# Altium project AIO_3399J_Schematic.PrjPcb (part 5 of 5)

## Sheet FAN.SchDoc
size B
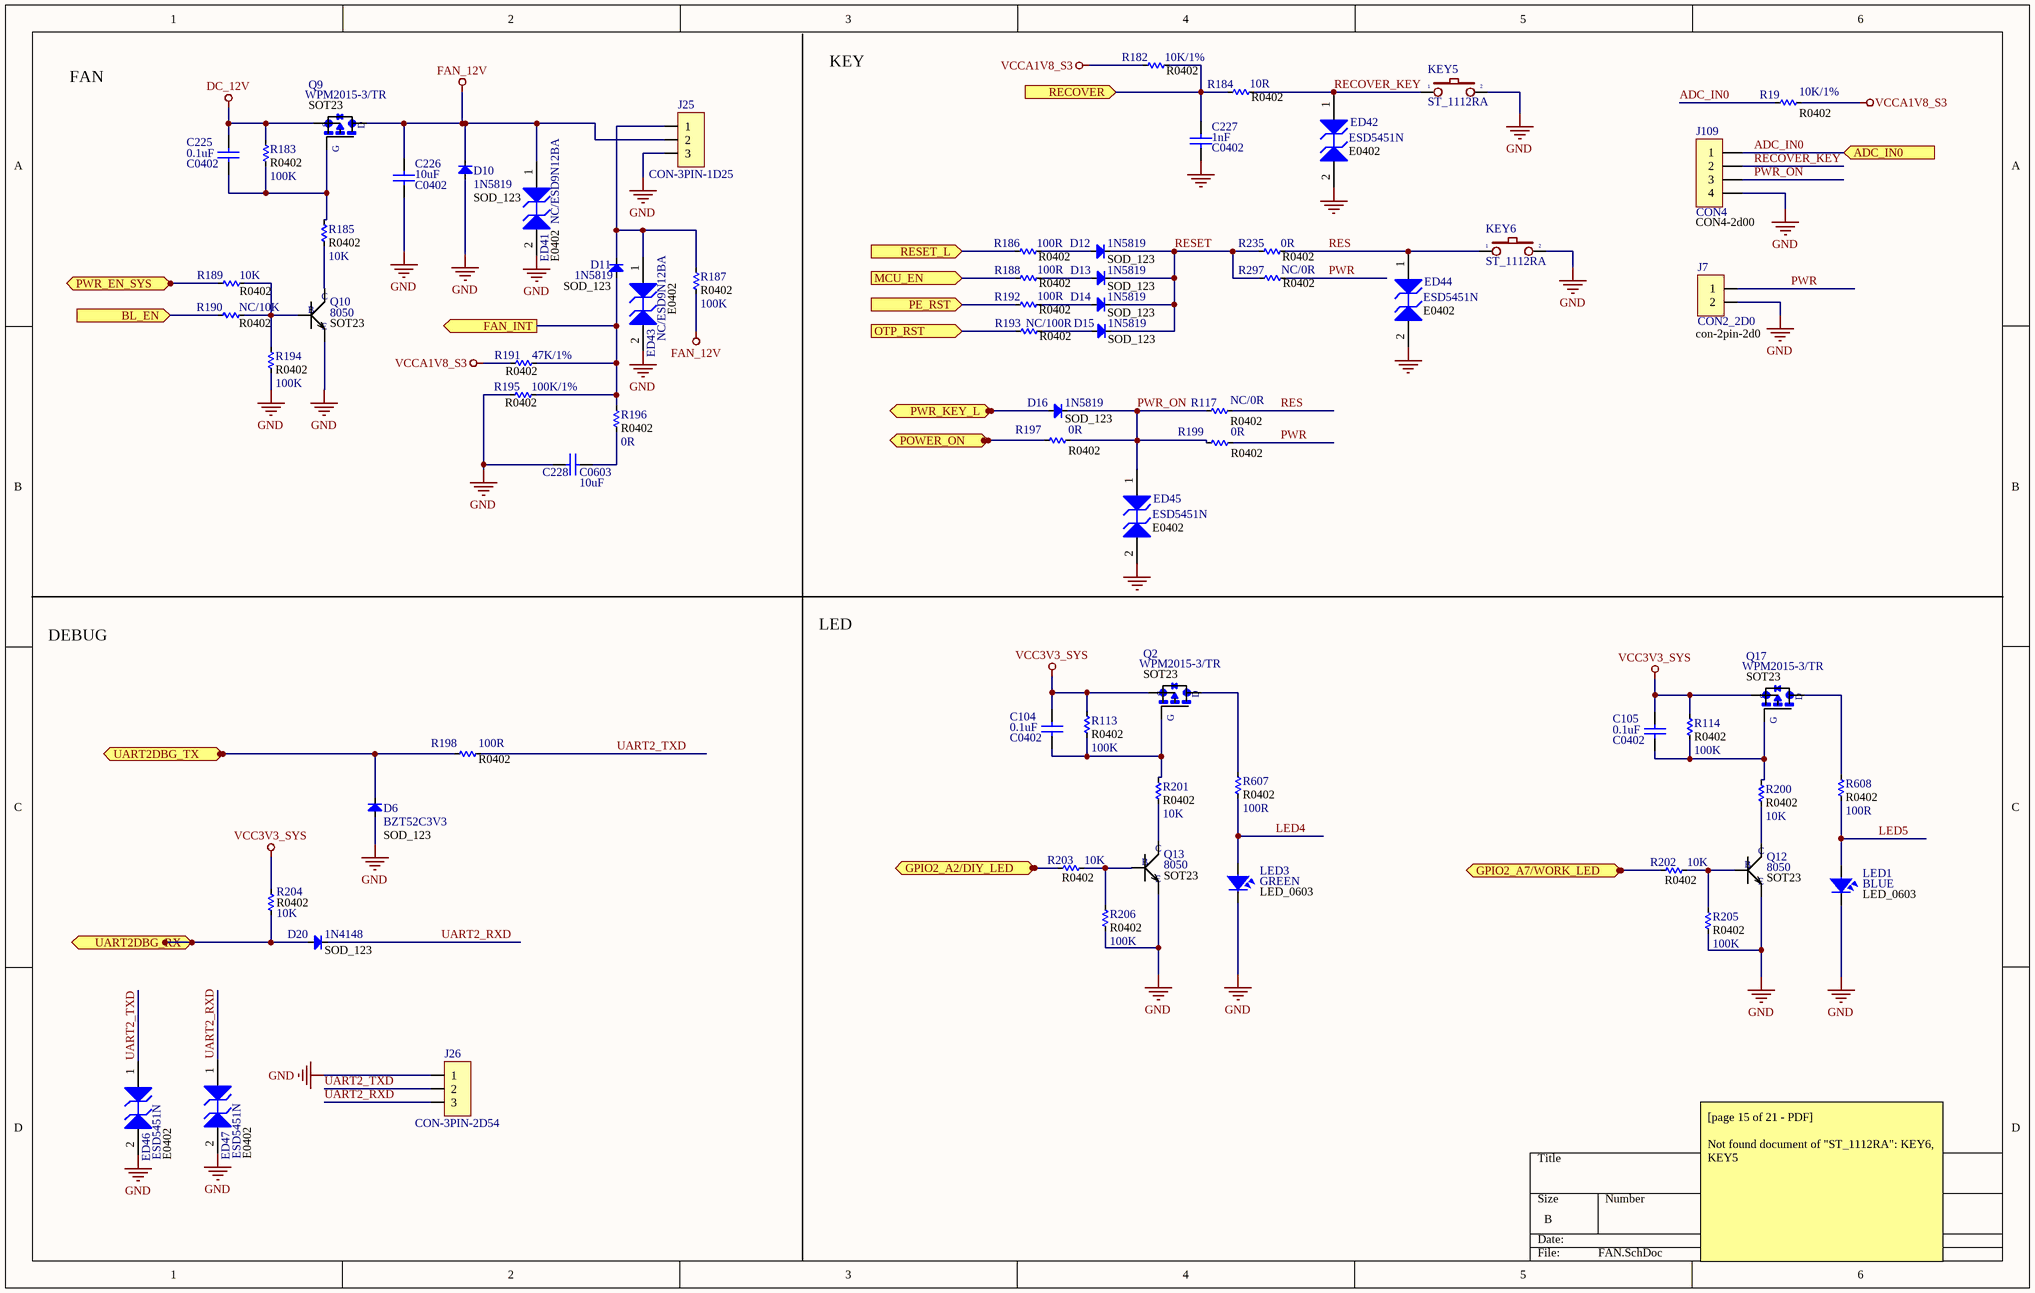
[diagram p20: FAN.SchDoc]

### Parts
C104  C0402  value 0.1uF  [C 0402]
C105  C0402  value 0.1uF  [C 0402]
C225  C0402  value 0.1uF  [C 0402]
C226  C0402  value 10uF  [C 0402]
C227  C0402  value 1nF  [C 0402]
C228  C0603  value 10uF  [C 0603]
D6  BZT52C3V3  typr: SOD_123  [DIO-SMD-123]
D10  value 1N5819  typr: SOD_123  [DIO-SMD-123]  (hidden comment: Diode SMD)
D11  value 1N5819  typr: SOD_123  [DIO-SMD-123]  (hidden comment: Diode SMD)
D12  value 1N5819  typr: SOD_123  [DIO-SMD-123]  (hidden comment: Diode SMD)
D13  value 1N5819  typr: SOD_123  [DIO-SMD-123]  (hidden comment: Diode SMD)
D14  value 1N5819  typr: SOD_123  [DIO-SMD-123]  (hidden comment: Diode SMD)
D15  value 1N5819  typr: SOD_123  [DIO-SMD-123]  (hidden comment: Diode SMD)
D16  value 1N5819  typr: SOD_123  [DIO-SMD-123]  (hidden comment: Diode SMD)
D20  value 1N4148  typr: SOD_123  [DIO-SMD-123]  (hidden comment: Diode SMD)
ED41  NC/ESD9N12BA  [DFN1006-2L]
ED42  ESD5451N  [DFN1006-2L]
ED43  NC/ESD9N12BA  [DFN1006-2L]
ED44  ESD5451N  [DFN1006-2L]
ED45  ESD5451N  [DFN1006-2L]
ED46  ESD5451N  [DFN1006-2L]
ED47  ESD5451N  [DFN1006-2L]
J7  CON2_2D0  [CON2]
J25  CON-3PIN-1D25  [CON3]
J26  CON-3PIN-2D54  [CON3]
J109  CON4  [CON4]
KEY5  ST_1112RA  [SW1-SMD]
KEY6  ST_1112RA  [SW1-SMD]
LED1  Package: LED_0603  Color: BLUE  [SM-LED-0805-Blue]  (hidden comment: LED SMD)
LED3  Package: LED_0603  Color: GREEN  [SM-LED-0805-Green]  (hidden comment: LED SMD)
Q2  WPM2015-3/TR  [*SSOT-3]
Q9  WPM2015-3/TR  [*SSOT-3]
Q10  8050  [*SOT-23]
Q12  8050  [*SOT-23]
Q13  8050  [*SOT-23]
Q17  WPM2015-3/TR  [*SSOT-3]
R19  R0402  value 10K/1%  [R 0402]
R113  R0402  value 100K  [R 0402]
R114  R0402  value 100K  [R 0402]
R117  R0402  value NC/0R  [R 0402]
R182  R0402  value 10K/1%  [R 0402]
R183  R0402  value 100K  [R 0402]
R184  R0402  value 10R  [R 0402]
R185  R0402  value 10K  [R 0402]
R186  R0402  value 100R  [R 0402]
R187  R0402  value 100K  [R 0402]
R188  R0402  value 100R  [R 0402]
R189  R0402  value 10K  [R 0402]
R190  R0402  value NC/10K  [R 0402]
R191  R0402  value 47K/1%  [R 0402]
R192  R0402  value 100R  [R 0402]
R193  R0402  value NC/100R  [R 0402]
R194  R0402  value 100K  [R 0402]
R195  R0402  value 100K/1%  [R 0402]
R196  R0402  value 0R  [R 0402]
R197  R0402  value 0R  [R 0402]
R198  R0402  value 100R  [R 0402]
R199  R0402  value 0R  [R 0402]
R200  R0402  value 10K  [R 0402]
R201  R0402  value 10K  [R 0402]
R202  R0402  value 10K  [R 0402]
R203  R0402  value 10K  [R 0402]
R204  R0402  value 10K  [R 0402]
R205  R0402  value 100K  [R 0402]
R206  R0402  value 100K  [R 0402]
R235  R0402  value 0R  [R 0402]
R297  R0402  value NC/0R  [R 0402]
R607  R0402  value 100R  [R 0402]
R608  R0402  value 100R  [R 0402]

### Ports
ADC_IN0 (in), BL_EN (in), FAN_INT (out), GPIO2_A2/DIY_LED (in), GPIO2_A7/WORK_LED (in), MCU_EN (in), OTP_RST (in), PE_RST (in), POWER_ON (in), PWR_EN_SYS (in), PWR_KEY_L (in), RECOVER (in), RESET_L (in), UART2DBG_RX (out), UART2DBG_TX (in)

### Nets
DC_12V: C225.1 Q9.2(S) R183.2
FAN_12V: C226.1 D10.2(K) ED41.1(A1) J25.2 Q9.3(D) R187.1
GND: C226.2 C227.2 C228.1 D6.1(A) D10.1(A) ED41.2(A2) ED42.2(A2) ED43.2(A2) ED44.2(A2) ED45.2(A2) ED46.2(A2) ED47.2(A2) J7.2 J25.3 J26.1 J109.4 KEY5.2 KEY6.2 LED1.2 LED3.2 Q10.2(E) Q12.2(E) Q13.2(E) R194.2 R195.2 R205.2 R206.2
VCC3V3_SYS: C104.1 C105.1 Q2.2(S) Q17.2(S) R113.1 R114.1 R204.1  [project net U27_VCC]
VCCA1V8_S3: R19.2 R182.1 R191.2
ADC_IN0: J109.1 R19.1 ; port ADC_IN0
BL_EN: R190.2 ; port BL_EN
FAN_INT: D11.1(A) R191.1 R195.1 R196.1 ; port FAN_INT
LED4: LED3.1 R607.2
LED5: LED1.1 R608.2
OTP_RST: R193.1 ; port OTP_RST
PE_RST: R192.1 ; port PE_RST
POWER_ON: R197.1 ; port POWER_ON
PWR: J7.1 R199.2 R297.2
PWR_KEY_L: D16.1(A) ; port PWR_KEY_L
PWR_ON: D16.2(K) ED45.1(A1) J109.3 R117.1 R197.2 R199.1
RECOVER: C227.1 R182.2 R184.1 ; port RECOVER
RECOVER_KEY: ED42.1(A1) J109.2 KEY5.1 R184.2
RES: ED44.1(A1) KEY6.1 R117.2 R235.2
RESET: D12.2(K) D13.2(K) D14.2(K) D15.2(K) R235.1 R297.1
RESET_L: R186.1 ; port RESET_L
UART2_RXD: D20.2(K) ED47.1(A1) J26.3
UART2_TXD: ED46.1(A1) J26.2 R198.2
UART2DBG_RX: D20.1(A) R204.2 ; port UART2DBG_RX
UART2DBG_TX: D6.2(K) R198.1 ; port UART2DBG_TX
NetC18_2: R188.1 ; port MCU_EN
NetC104_2: C104.2 Q2.1(G) R113.2 R201.1
NetC105_2: C105.2 Q17.1(G) R114.2 R200.1
NetC225_2: C225.2 Q9.1(G) R183.1 R185.2
NetC228_2: C228.2 R196.2
NetD11_2: D11.2(K) ED43.1(A1) J25.1 R187.2
NetD12_1: D12.1(A) R186.2
NetD13_1: D13.1(A) R188.2
NetD14_1: D14.1(A) R192.2
NetD15_1: D15.1(A) R193.2
NetJ38_69: R203.1 ; port GPIO2_A2/DIY_LED
NetJ38_79: R202.1 ; port GPIO2_A7/WORK_LED
NetQ2_3: Q2.3(D) R607.1
NetQ10_1: Q10.1(B) R189.1 R190.1 R194.1
NetQ10_3: Q10.3(C) R185.1
NetQ12_1: Q12.1(B) R202.2 R205.1
NetQ12_3: Q12.3(C) R200.2
NetQ13_1: Q13.1(B) R203.2 R206.1
NetQ13_3: Q13.3(C) R201.2
NetQ17_3: Q17.3(D) R608.1
NetR7_2: R189.2 ; port PWR_EN_SYS

### Notes on the sheet
- FAN
- KEY
- LED
- DEBUG
- [page 15 of 21 - PDF]
  Not found document of "ST_1112RA": KEY6, KEY5
- (in symbol 1SMB54CAT3) E0402
- (in symbol FDN304P) SOT23
- (in symbol JP2) con-2pin-2d0
- (in symbol JP4x1-2.0) CON4-2d00
- (in symbol SMD-TRANSISTORS-NPN-25V-500MW(SOT-23)) SOT23

### Library data of the parts
C104 C105 C225-C228 = Cap: Capacitor; Published: 8-Jun-2000; LatestRevisionDate: 17-Jul-2002; LatestRevisionNote: Re-released for DXP Platform.; PackageReference: RAD-0.3; Publisher: Altium Limited; PackageDescription: Radial Cap, Thru-Hole; 2 Leads; 0.3 in Pin Spacing
D6 D10-D16 D20 = Diode SMD: Default Diode; Code - JEDEC: DO-214-AB; Published: 8-Jun-2000; Revision: July-2002: Re-released for DXP Platform.; Publisher: Altium Limited
  D6: Value: BZT52C3V3
ED41-ED47 = 1SMB54CAT3: 600 W Peak Power Zener Transient Voltage Suppressor, Bidirectional, 2-Pin SMB, Tape and Reel; Manufacturer: On Semiconductor; IR Max (uA): 5; PPK Max (W): 600; V(BR) Typ (V): 63.16; DatasheetVersion: Rev. A; PackageVersion: Rev. A, 01/2000; PackageReference: SMB-2-403C-01; PackageDescription: 2-Pin Small Molded Package, J-Bend Lead, Body 4.315 x 3.555 mm; Supplier 1: Digi-Key; Supplier Part Number 1: 1SMB54CAT3-ND; Direction: Bidirectional; Packing: Tape and Reel; Mounting Technology: Surface Mount; PartNumber: 1SMB54CAT3; ComponentLink1Description: Manufacturer URL; ComponentLink1URL: http://www.onsemi.com/; ComponentLink2Description: Datasheet; ComponentLink2URL: http://www.onsemi.com/pub_link/Collateral/1SMB10CAT3-D.PDF; ComponentLink3Description: Package Specification; ComponentLink3URL: http://www.onsemi.com/pub_link/Collateral/1SMB10CAT3-D.PDF
J7 = JP2: WR-PHD 2.54 mm Angled Socket Header; Manufacturer: W¨¹rth Elektronik eiSos GmbH; partNo: 613002143121; ComponentLink1 Description: Manufacturer; ComponentLink2 Description: Datasheet; NoPins: 02; Created Date: 29 March 2013; ComponentLink1URL: http://www.we-online.com; ComponentLink2URL: http://katalog.we-online.de/em/datasheet/6130xx143121.pdf; Created by: Karrer Zheng
J25 J26 = JP3: WR-PHD 2.54 mm Angled Socket Header; Manufacturer: W¨¹rth Elektronik eiSos GmbH; partNo: 613003143121; ComponentLink1 Description: Manufacturer; ComponentLink2 Description: Datasheet; NoPins: 03; Created Date: 29 March 2013; ComponentLink1URL: http://www.we-online.com; ComponentLink2URL: http://katalog.we-online.de/em/datasheet/6130xx143121.pdf; Created by: Karrer Zheng
J109 = JP4x1-2.0: WR-PHD 2.00 mm Socket Header; Manufacturer: W¨¹rth Elektronik eiSos GmbH; partNo: 62000411821; ComponentLink1 Description: Manufacturer; ComponentLink2 Description: Datasheet; NoPins: 04; Created Date: 2 April 2013; ComponentLink1URL: http://www.we-online.com; ComponentLink2URL: http://katalog.we-online.de/em/datasheet/6200xx11821.pdf; Created by: Karrer Zheng
KEY5 KEY6 = SW2: Switch button 2 pin; Value: SW chip 2 pin
LED1 LED3 = LED-SMD-0805
Q2 Q9 Q17 = FDN304P: P-Channel 20 V 52 mOhm 1.8V Surface Mount Specified PowerTrench Mosfet SSOT-3; MF: ON Semiconductor; Package: SC-59 ON Semiconductor; MP: FDN304P; Price: None; SnapEDA_Link: https://www.snapeda.com/parts/FDN304P/ON%20Semiconductor/view-part/?ref=snap; Availability: Unavailable; Value: *
Q10 Q12 Q13 = SMD-TRANSISTORS-NPN-25V-500MW(SOT-23): MF: Recom Power; MP: S8050; Package: SMD-8 Samsung; Price: None; SnapEDA_Link: https://www.snapeda.com/parts/S8050/Recom%20Power/view-part/?ref=snap; Availability: Unavailable; Value: *
R19 R113 R114 R117 R182-R206 R235 R297 R607 R608 = Res-SMD: Resistor; Manufacturer: Generic Components; Class: Passive; Published: 08/06/2000; Publisher: Altium Hobart Technology Centre

## Sheet 3G4G.SchDoc
size C
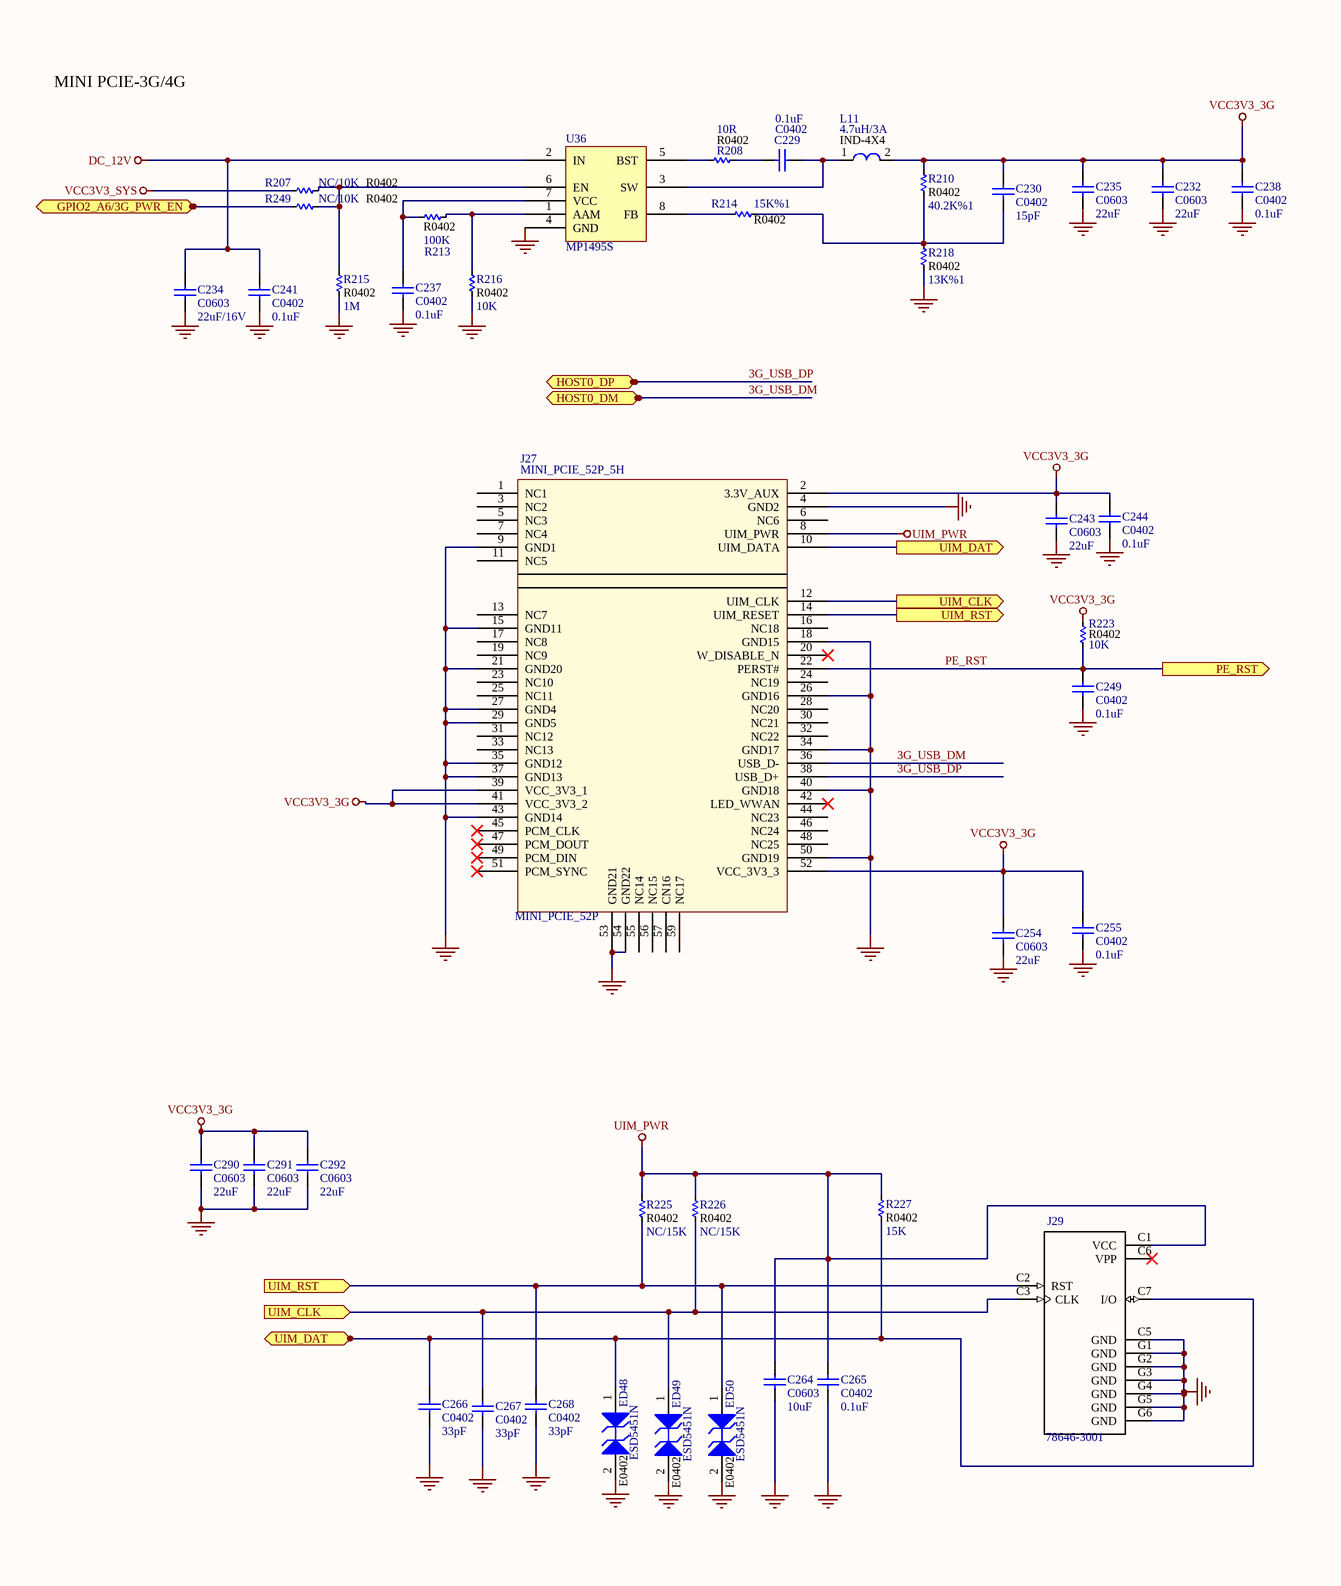
[diagram p21: 3G4G.SchDoc, left]
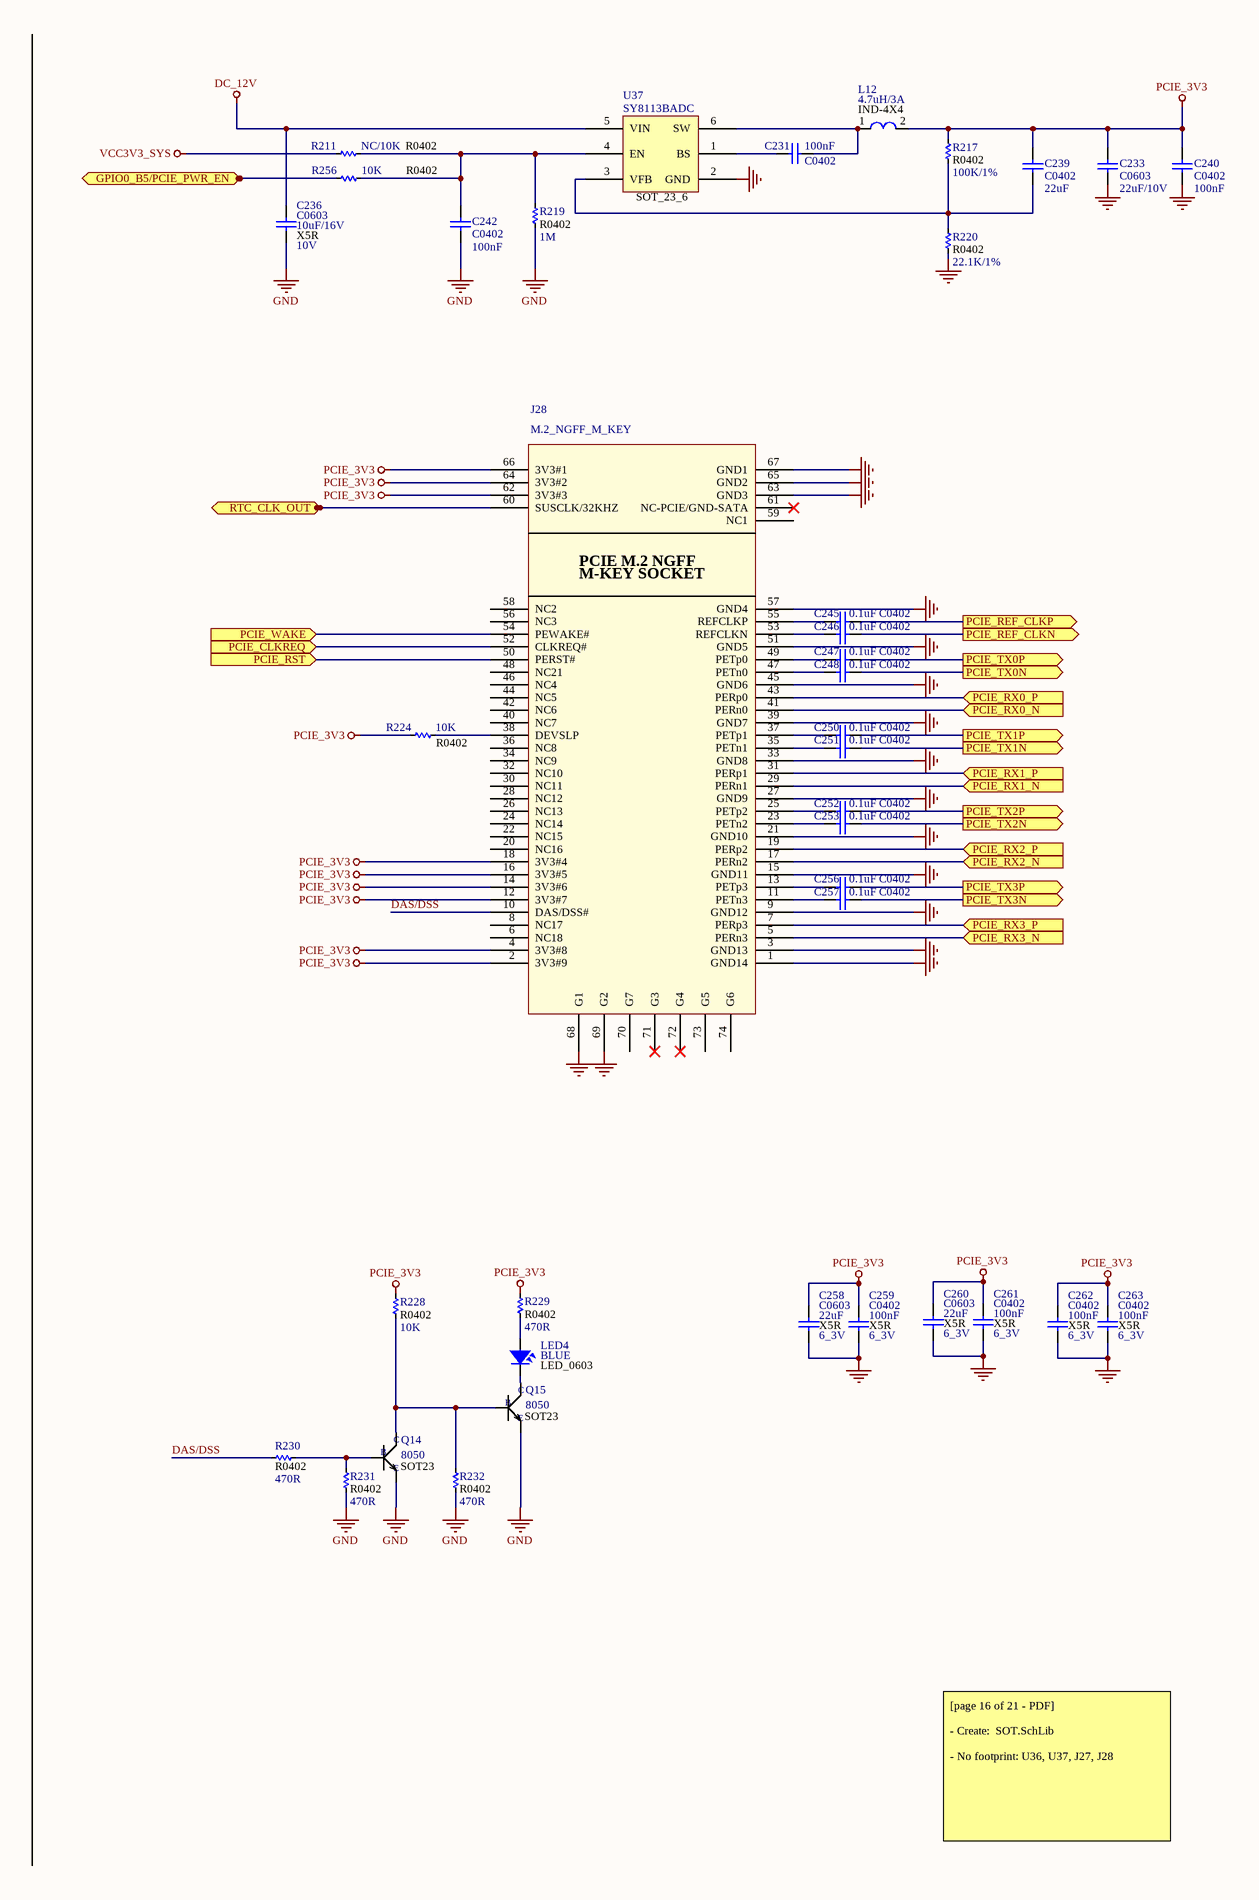
[diagram p22: 3G4G.SchDoc, right]

### Parts
C229  C0402  value 0.1uF  [C 0402]
C230  C0402  value 15pF  [C 0402]
C231  C0402  value 100nF  [C 0402]
C232  C0603  value 22uF  [C 0603]
C233  C0603  value 22uF/10V  [C 0603]
C234  C0603  value 22uF/16V  [C 0603]
C235  C0603  value 22uF  [C 0603]
C236  C0603  value 10uF/16V  [C 0603]
C237  C0402  value 0.1uF  [C 0402]
C238  C0402  value 0.1uF  [C 0402]
C239  C0402  value 22uF  [C 0402]
C240  C0402  value 100nF  [C 0402]
C241  C0402  value 0.1uF  [C 0402]
C242  C0402  value 100nF  [C 0402]
C243  C0603  value 22uF  [C 0603]
C244  C0402  value 0.1uF  [C 0402]
C245  C0402  value 0.1uF  [C 0402]
C246  C0402  value 0.1uF  [C 0402]
C247  C0402  value 0.1uF  [C 0402]
C248  C0402  value 0.1uF  [C 0402]
C249  C0402  value 0.1uF  [C 0402]
C250  C0402  value 0.1uF  [C 0402]
C251  C0402  value 0.1uF  [C 0402]
C252  C0402  value 0.1uF  [C 0402]
C253  C0402  value 0.1uF  [C 0402]
C254  C0603  value 22uF  [C 0603]
C255  C0402  value 0.1uF  [C 0402]
C256  C0402  value 0.1uF  [C 0402]
C257  C0402  value 0.1uF  [C 0402]
C258  C0603  value 22uF  [C 0603]
C259  C0402  value 100nF  [C 0402]
C260  C0603  value 22uF  [C 0603]
C261  C0402  value 100nF  [C 0402]
C262  C0402  value 100nF  [C 0402]
C263  C0402  value 100nF  [C 0402]
C264  C0603  value 10uF  [C 0603]
C265  C0402  value 0.1uF  [C 0402]
C266  C0402  value 33pF  [C 0402]
C267  C0402  value 33pF  [C 0402]
C268  C0402  value 33pF  [C 0402]
C290  C0603  value 22uF  [C 0603]
C291  C0603  value 22uF  [C 0603]
C292  C0603  value 22uF  [C 0603]
ED48  ESD5451N  size: E0402  [DFN1006-2L]
ED49  ESD5451N  size: E0402  [DFN1006-2L]
ED50  ESD5451N  size: E0402  [DFN1006-2L]
J27  MINI_PCIE_52P_5H  [MINI_PCIE_52PIN]
J28  M.2_NGFF_M_KEY  [*CONN_1-2199230-5_1-2199230-5(Primary)]
J29  78646-3001  [*CONN_78646-3001_78646-3001(Primary)]
L11  4.7uH/3A  [L-SMD-M-7.3x4.5]
L12  4.7uH/3A  [L-SMD-M-7.3x4.5]
LED4  Package: LED_0603  Color: BLUE  [SM-LED-0805-Blue]  (hidden comment: LED SMD)
Q14  8050  [*SOT-23]
Q15  8050  [*SOT-23]
R207  R0402  value NC/10K  [R 0402]
R208  R0402  value 10R  [R 0402]
R210  R0402  value 40.2K%1  [R 0402]
R211  R0402  value NC/10K  [R 0402]
R213  R0402  value 100K  [R 0402]
R214  R0402  value 15K%1  [R 0402]
R215  R0402  value 1M  [R 0402]
R216  R0402  value 10K  [R 0402]
R217  R0402  value 100K/1%  [R 0402]
R218  R0402  value 13K%1  [R 0402]
R219  R0402  value 1M  [R 0402]
R220  R0402  value 22.1K/1%  [R 0402]
R223  R0402  value 10K  [R 0402]
R224  R0402  value 10K  [R 0402]
R225  R0402  value NC/15K  [R 0402]
R226  R0402  value NC/15K  [R 0402]
R227  R0402  value 15K  [R 0402]
R228  R0402  value 10K  [R 0402]
R229  R0402  value 470R  [R 0402]
R230  R0402  value 470R  [R 0402]
R231  R0402  value 470R  [R 0402]
R232  R0402  value 470R  [R 0402]
R249  R0402  value NC/10K  [R 0402]
R256  R0402  value 10K  [R 0402]
U36  MP1495S  [TSOT-23-8]
U37  SOT-23-6_SY8113BADC  [SOT-23-6]  (value not drawn)

### Ports
GPIO0_B5/PCIE_PWR_EN (in), GPIO2_A6/3G_PWR_EN (in), HOST0_DM (in), HOST0_DP (in), PCIE_CLKREQ (in), PCIE_REF_CLKN (out), PCIE_REF_CLKP (out), PCIE_RST (in), PCIE_RX0_N (in), PCIE_RX0_P (in), PCIE_RX1_N (in), PCIE_RX1_P (in), PCIE_RX2_N (in), PCIE_RX2_P (in), PCIE_RX3_N (in), PCIE_RX3_P (in), PCIE_TX0N (out), PCIE_TX0P (out), PCIE_TX1N (out), PCIE_TX1P (out), PCIE_TX2N (out), PCIE_TX2P (out), PCIE_TX3N (out), PCIE_TX3P (out), PCIE_WAKE (in), PE_RST (out), RTC_CLK_OUT (in), UIM_CLK (in), UIM_CLK (out), UIM_DAT (in), UIM_DAT (out), UIM_RST (in), UIM_RST (out)

### Nets
DC_12V: C234.1 C236.1 C241.1 U36.2(IN) U37.5(VIN)
GND: C232.1 C233.1 C234.2 C235.1 C236.2 C237.2 C238.1 C240.1 C241.2 C242.2 C243.1 C244.1 C249.1 C254.1 C255.1 C258.1 C259.1 C260.1 C261.1 C262.1 C263.1 C264.1 C265.1 C266.1 C267.1 C268.1 C290.1 C291.1 C292.1 ED48.2(A2) ED49.2(A2) ED50.2(A2) J27.4(GND2) J27.9(GND1) J27.15(GND11) J27.18(GND15) J27.21(GND20) J27.26(GND16) J27.27(GND4) J27.29(GND5) J27.34(GND17) J27.35(GND12) J27.37(GND13) J27.40(GND18) J27.43(GND14) J27.50(GND19) J27.53(GND21) J27.54(GND22) J28.1(GND14) J28.3(GND13) J28.9(GND12) J28.15(GND11) J28.21(GND10) J28.27(GND9) J28.33(GND8) J28.39(GND7) J28.45(GND6) J28.51(GND5) J28.57(GND4) J28.63(GND3) J28.65(GND2) J28.67(GND1) J28.68(G1) J28.69(G2) J29.C5(GND) J29.G1(GND) J29.G2(GND) J29.G3(GND) J29.G4(GND) J29.G5(GND) J29.G6(GND) Q14.2(E) Q15.2(E) R215.1 R216.1 R218.1 R219.2 R220.1 R231.2 R232.2 U36.4(GND) U37.2(GND)
PCIE_3V3: C233.2 C239.2 C240.2 C258.2 C259.2 C260.2 C261.2 C262.2 C263.2 J28.2(3V3#9) J28.4(3V3#8) J28.12(3V3#7) J28.14(3V3#6) J28.16(3V3#5) J28.18(3V3#4) J28.62(3V3#3) J28.64(3V3#2) J28.66(3V3#1) L12.2 R217.2 R224.2 R228.2 R229.2
UIM_PWR: C264.2 C265.2 J27.8(UIM_PWR) J29.C1(VCC) R225.2 R226.2 R227.2
VCC3V3_3G: C230.2 C232.2 C235.2 C238.2 C243.2 C244.2 C254.2 C255.2 C290.2 C291.2 C292.2 J27.2(3.3V_AUX) J27.39(VCC_3V3_1) J27.41(VCC_3V3_2) J27.52(VCC_3V3_3) L11.2 R210.2 R223.2
VCC3V3_SYS: R207.2 R211.2  [project net U27_VCC]
3G_USB_DM: J27.36(USB_D-) ; port HOST0_DM
3G_USB_DP: J27.38(USB_D+) ; port HOST0_DP
DAS/DSS: J28.10(DAS/DSS#) R230.2
PCIE_CLKREQ: J28.52(CLKREQ#) ; port PCIE_CLKREQ
PCIE_REF_CLKN: C246.1 ; port PCIE_REF_CLKN
PCIE_REF_CLKP: C245.1 ; port PCIE_REF_CLKP
PCIE_RST: J28.50(PERST#) ; port PCIE_RST
PCIE_RX0_N: J28.41(PERn0) ; port PCIE_RX0_N
PCIE_RX0_P: J28.43(PERp0) ; port PCIE_RX0_P
PCIE_RX1_N: J28.29(PERn1) ; port PCIE_RX1_N
PCIE_RX1_P: J28.31(PERp1) ; port PCIE_RX1_P
PCIE_RX2_N: J28.17(PERn2) ; port PCIE_RX2_N
PCIE_RX2_P: J28.19(PERp2) ; port PCIE_RX2_P
PCIE_RX3_N: J28.5(PERn3) ; port PCIE_RX3_N
PCIE_RX3_P: J28.7(PERp3) ; port PCIE_RX3_P
PCIE_TX0N: C248.1 ; port PCIE_TX0N
PCIE_TX0P: C247.1 ; port PCIE_TX0P
PCIE_TX1N: C251.1 ; port PCIE_TX1N
PCIE_TX1P: C250.1 ; port PCIE_TX1P
PCIE_TX2N: C253.1 ; port PCIE_TX2N
PCIE_TX2P: C252.1 ; port PCIE_TX2P
PCIE_TX3N: C257.1 ; port PCIE_TX3N
PCIE_TX3P: C256.1 ; port PCIE_TX3P
PCIE_WAKE: J28.54(PEWAKE#) ; port PCIE_WAKE
PE_RST: C249.2 J27.22(PERST#) R223.1 ; port PE_RST
RTC_CLK_OUT: J28.60(SUSCLK/32KHZ) ; port RTC_CLK_OUT
NetC229_1: C229.1 R208.2
NetC229_2: C229.2 L11.1 U36.3(SW)
NetC230_1: C230.1 R210.1 R214.2 R218.2
NetC231_1: C231.1 L12.1 U37.6(SW)
NetC231_2: C231.2 U37.1(BS)
NetC237_1: C237.1 R213.1 U36.7(VCC)
NetC239_1: C239.1 R217.1 R220.2 U37.3(VFB)
NetC242_1: C242.1 R211.1 R219.1 R256.1 U37.4(EN)
NetC245_2: C245.2 J28.55(REFCLKP)
NetC246_2: C246.2 J28.53(REFCLKN)
NetC247_2: C247.2 J28.49(PETp0)
NetC248_2: C248.2 J28.47(PETn0)
NetC250_2: C250.2 J28.37(PETp1)
NetC251_2: C251.2 J28.35(PETn1)
NetC252_2: C252.2 J28.25(PETp2)
NetC253_2: C253.2 J28.23(PETn2)
NetC256_2: C256.2 J28.13(PETp3)
NetC257_2: C257.2 J28.11(PETn3)
NetC266_2: C266.2 ED48.1(A1) J27.10(UIM_DATA) J29.C7(I/O) R227.1 ; port UIM_DAT
NetC267_2: C267.2 ED49.1(A1) J27.12(UIM_CLK) J29.C3(CLK) R226.1 ; port UIM_CLK
NetC268_2: C268.2 ED50.1(A1) J27.14(UIM_RESET) J29.C2(RST) R225.1 ; port UIM_RST
NetJ28_38: J28.38(DEVSLP) R224.1
NetJ38_77: R249.2 ; port GPIO2_A6/3G_PWR_EN
NetJ38_179: R256.2 ; port GPIO0_B5/PCIE_PWR_EN
NetLED4_1: LED4.1 R229.1
NetLED4_2: LED4.2 Q15.3(C)
NetQ14_1: Q14.1(B) R230.1 R231.1
NetQ14_3: Q14.3(C) Q15.1(B) R228.1 R232.1
NetR207_1: R207.1 R215.2 R249.1 U36.6(EN)
NetR208_1: R208.1 U36.5(BST)
NetR213_2: R213.2 R216.2 U36.1(AAM)
NetR214_1: R214.1 U36.8(FB)

Not connected (* = marked no-connect by the designer): J27 1(NC1) 3(NC2) 5(NC3) 6(NC6) 7(NC4) 11(NC5) 13(NC7) 16(NC18) 17(NC8) 19(NC9) 20(W_DISABLE_N)* 23(NC10) 24(NC19) 25(NC11) 28(NC20) 30(NC21) 31(NC12) 32(NC22) 33(NC13) 42(LED_WWAN)* 44(NC23) 45(PCM_CLK)* 46(NC24) 47(PCM_DOUT)* 48(NC25) 49(PCM_DIN)* 51(PCM_SYNC)* 55(NC14) 56(NC15) 57(CN16) 59(NC17); J28 6(NC18) 8(NC17) 20(NC16) 22(NC15) 24(NC14) 26(NC13) 28(NC12) 30(NC11) 32(NC10) 34(NC9) 36(NC8) 40(NC7) 42(NC6) 44(NC5) 46(NC4) 48(NC21) 56(NC3) 58(NC2) 59(NC1) 61(NC-PCIE/GND-SATA)* 70(G7) 71(G3)* 72(G4)* 73(G5) 74(G6); J29 C6(VPP)*

### Notes on the sheet
- MINI PCIE-3G/4G
- [page 16 of 21 - PDF]
  - Create:  SOT.SchLib
  - No footprint: U36, U37, J27, J28
- (in symbol Cap) X5R; 6_3V; 10V
- (in symbol L-SMD-1) IND-4X4
- (in symbol M.2_NGFF_M_KEY) PCIE M.2 NGFF; M-KEY SOCKET
- (in symbol MINI_PCIE_52P_5H) MINI_PCIE_52P
- (in symbol SMD-TRANSISTORS-NPN-25V-500MW(SOT-23)) SOT23
- (in symbol SOT-23-6_SY8113BADC) SY8113BADC; SOT_23_6

### Library data of the parts
C229-C268 C290-C292 = Cap: Capacitor; Published: 8-Jun-2000; LatestRevisionDate: 17-Jul-2002; LatestRevisionNote: Re-released for DXP Platform.; PackageReference: RAD-0.3; Publisher: Altium Limited; PackageDescription: Radial Cap, Thru-Hole; 2 Leads; 0.3 in Pin Spacing
ED48-ED50 = 1SMB54CAT3: as ED41-ED47 on sheet FAN; DatasheetVersion: Rev. A; PackageVersion: Rev. A, 01/2000; PackageReference: SMB-2-403C-01; PackageDescription: 2-Pin Small Molded Package, J-Bend Lead, Body 4.315 x 3.555 mm; Supplier 1: Digi-Key; Supplier Part Number 1: 1SMB54CAT3-ND; Direction: Bidirectional; Packing: Tape and Reel; Mounting Technology: Surface Mount; PartNumber: 1SMB54CAT3; ComponentLink1Description: Manufacturer URL; ComponentLink1URL: http://www.onsemi.com/; ComponentLink2Description: Datasheet; ComponentLink2URL: http://www.onsemi.com/pub_link/Collateral/1SMB10CAT3-D.PDF; ComponentLink3Description: Package Specification; ComponentLink3URL: http://www.onsemi.com/pub_link/Collateral/1SMB10CAT3-D.PDF
J29 = 78646-3001: Conn Micro SIM Card SKT 6 POS 2.54mm Solder RA SMD 0.5A/Contact Embossed T/R; MF: Molex; Price: None; SnapEDA_Link: https://www.snapeda.com/parts/78646-3001/Molex/view-part/?ref=snap; Availability: Unavailable; MP: 78646-3001; Package: None; Value: *
L11 L12 = L-SMD-1: partNo: 78477010; Manufacturer: Wurth Elektronik; Inductance: 1.0 μH; ComponentLink1Description: Manufacturer; ComponentLink1URL: http://www.we-online.de; Created by: Baojun Chen; Created Date: Nov.2015; ComponentLink2Description: Datasheet; ComponentLink2URL: http://katalog.we-online.de/pbs/datasheet/78477010.pdf
LED4 = LED-SMD-0805
Q14 Q15 = SMD-TRANSISTORS-NPN-25V-500MW(SOT-23): MF: Recom Power; MP: S8050; Value: NC; Package: SMD-8 Samsung; Price: None; SnapEDA_Link: https://www.snapeda.com/parts/S8050/Recom%20Power/view-part/?ref=snap; Availability: Unavailable
R207 R208 R210 R211 R213-R220 R223-R232 R249 R256 = Res-SMD: as R19 on sheet FAN; Published: 08/06/2000; Publisher: Altium Hobart Technology Centre
U37 = SOT-23-6_SY8113BADC: Switching Voltage Regulators 17 Vin,3A Sync SD Reg; Manufacturer: Texas Instruments; Manufacturer Part Number: TPS563200DDCR; Operating Supply Current: 190 uA; Supplier 1: Mouser; RoHS: RoHS Compliant; Category: Switching Voltage Regulators; Stock 1: 18637; Pricing 1: 1=1.44, 10=1.23, 100=0.947, 500=0.836, 1000=0.660, 3000=0.586, 9000=0.564 (USD); Height: 1.1 mm; Length: 2.9 mm; Operating Temperature Range: - 40 C to + 125 C; Package / Case: SOT-23-Thin-6; Packaging: Cut Tape; Series: TPS563200; Width: 1.6 mm; Brand: Texas Instruments; Mounting Style: SMD/SMT; Maximum Operating Temperature: + 125 C; Minimum Operating Temperature: - 40 C; Product Type: Switching Voltage Regulators; Standard Pack Qty: 3000; Subcategory: PMIC - Power Management ICs; RoHS - Mouser: Y; Minimum Order Quantity: 1; Reeling: True

## Sheet CAMERA.SchDoc
size B
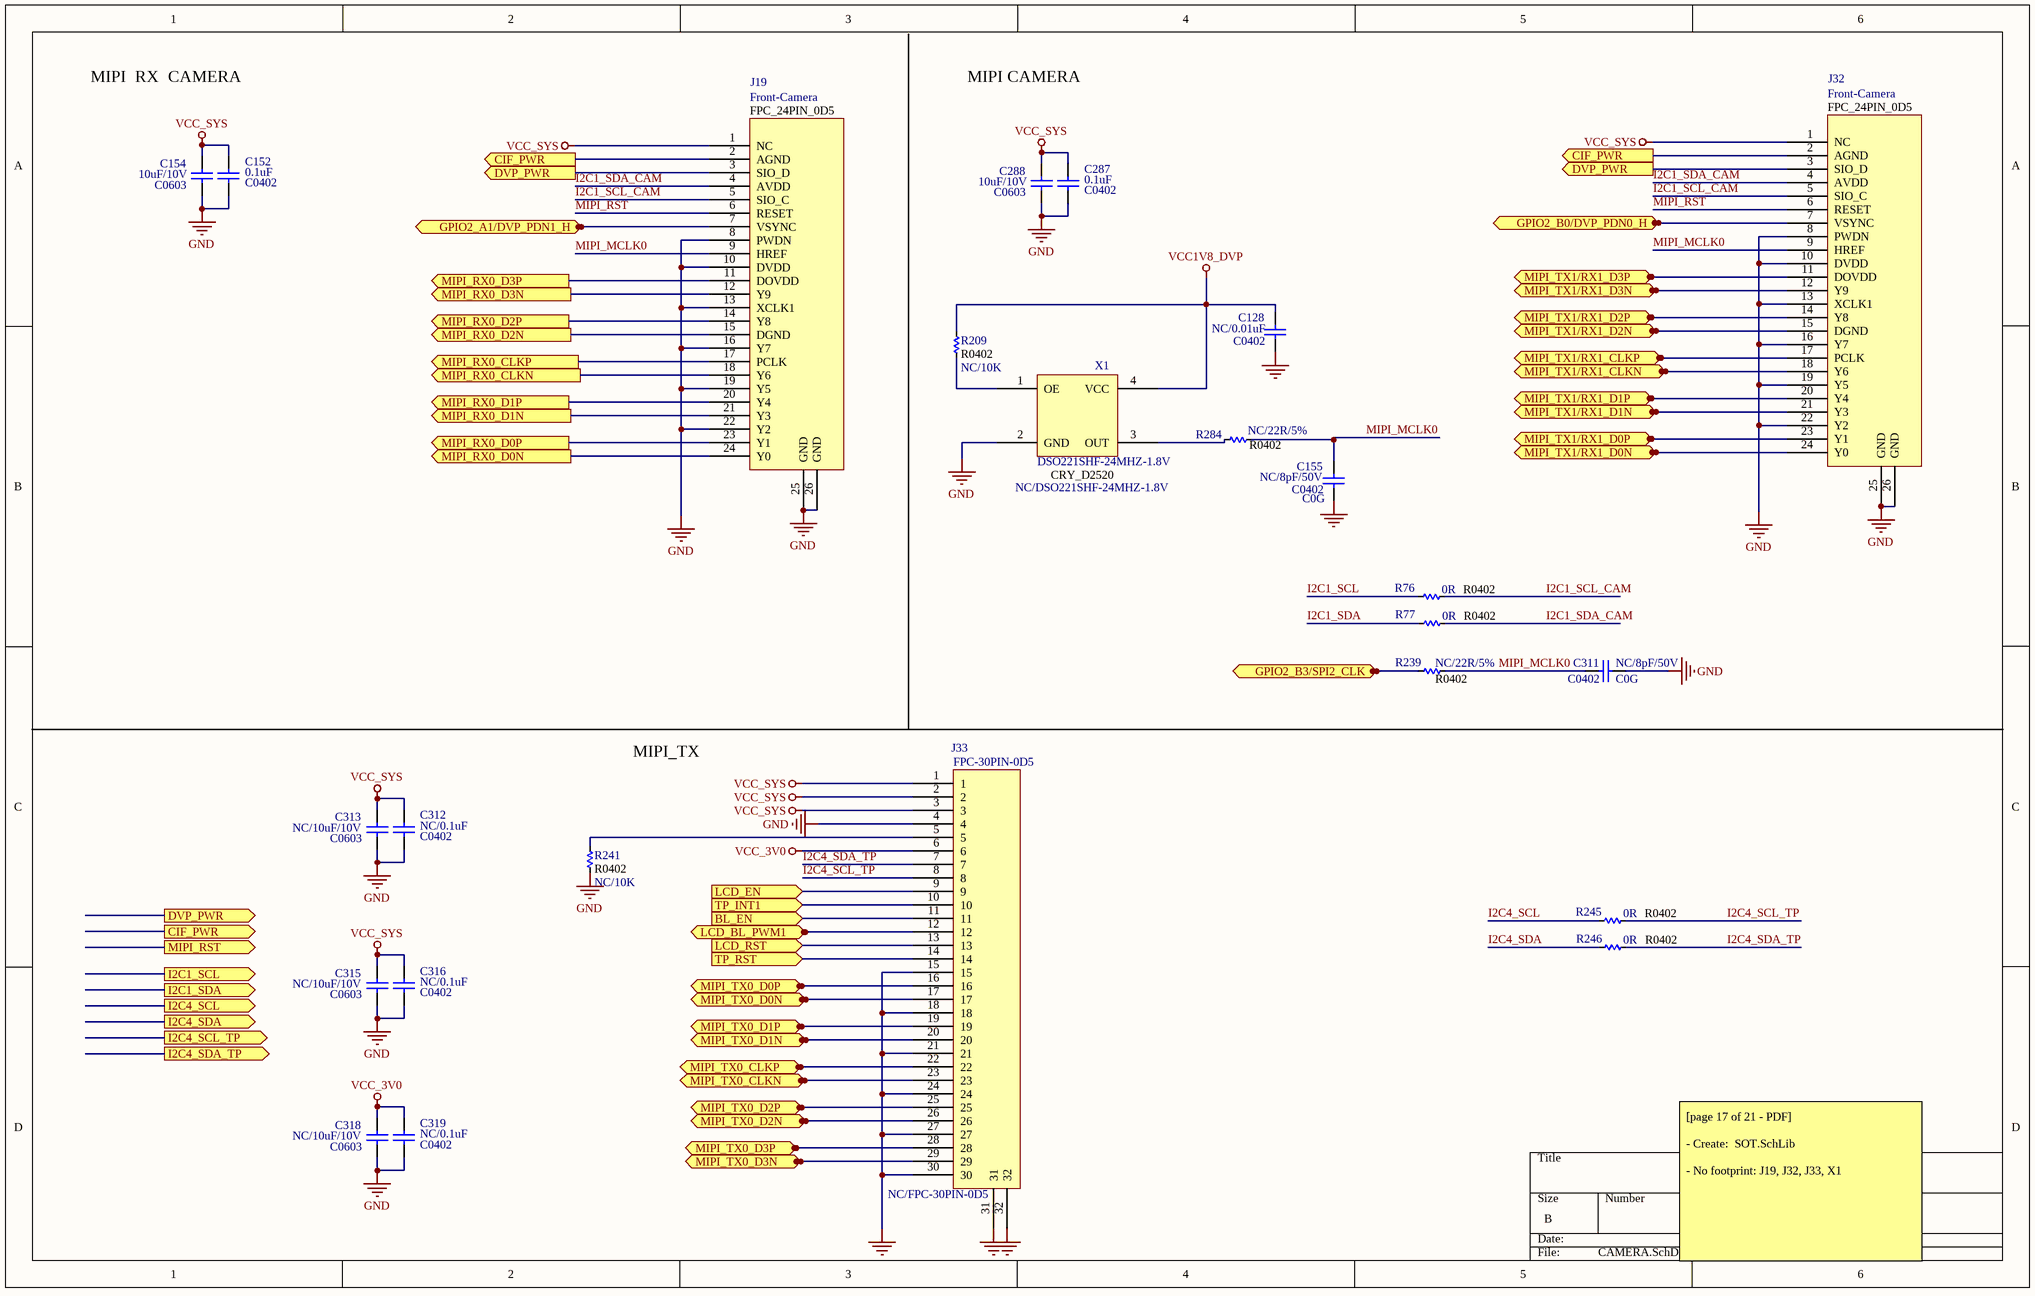
[diagram p23: CAMERA.SchDoc]

### Parts
C128  C0402  value NC/0.01uF  [C 0402]
C152  C0402  value 0.1uF  [C 0402]
C154  C0603  value 10uF/10V  [C 0603]
C155  C0402  value NC/8pF/50V  [C 0402]
C287  C0402  value 0.1uF  [C 0402]
C288  C0603  value 10uF/10V  [C 0603]
C311  C0402  value NC/8pF/50V  [C 0402]
C312  C0402  value NC/0.1uF  [C 0402]
C313  C0603  value NC/10uF/10V  [C 0603]
C315  C0603  value NC/10uF/10V  [C 0603]
C316  C0402  value NC/0.1uF  [C 0402]
C318  C0603  value NC/10uF/10V  [C 0603]
C319  C0402  value NC/0.1uF  [C 0402]
J19  FPC_24PIN_0D5  [FPC-24Pin]  (value not drawn)
J32  FPC_24PIN_0D5  [FPC-24Pin]  (value not drawn)
J33  NC/FPC-30PIN-0D5  [FPC-30pin]
R76  R0402  value 0R  [R 0402]
R77  R0402  value 0R  [R 0402]
R209  R0402  value NC/10K  [R 0402]
R239  R0402  value NC/22R/5%  [R 0402]
R241  R0402  value NC/10K  [R 0402]
R245  R0402  value 0R  [R 0402]
R246  R0402  value 0R  [R 0402]
R284  R0402  value NC/22R/5%  [R 0402]
X1  CRY_D2520  [Crystal 4-SMD 32x25]  (value not drawn)

### Ports
BL_EN (in), CIF_PWR (out), DVP_PWR (out), GPIO2_A1/DVP_PDN1_H (in), GPIO2_B0/DVP_PDN0_H (in), GPIO2_B3/SPI2_CLK (in), I2C1_SCL (out), I2C1_SDA (out), I2C4_SCL (out), I2C4_SCL_TP (out), I2C4_SDA (out), I2C4_SDA_TP (out), LCD_BL_PWM1 (in), LCD_EN (in), LCD_RST (in), MIPI_RST (out), MIPI_RX0_CLKN (out), MIPI_RX0_CLKP (out), MIPI_RX0_D0N (out), MIPI_RX0_D0P (out), MIPI_RX0_D1N (out), MIPI_RX0_D1P (out), MIPI_RX0_D2N (out), MIPI_RX0_D2P (out), MIPI_RX0_D3N (out), MIPI_RX0_D3P (out), MIPI_TX0_CLKN (in), MIPI_TX0_CLKP (in), MIPI_TX0_D0N (in), MIPI_TX0_D0P (in), MIPI_TX0_D1N (in), MIPI_TX0_D1P (in), MIPI_TX0_D2N (in), MIPI_TX0_D2P (in), MIPI_TX0_D3N (in), MIPI_TX0_D3P (in), MIPI_TX1/RX1_CLKN (out), MIPI_TX1/RX1_CLKP (out), MIPI_TX1/RX1_D0N (out), MIPI_TX1/RX1_D0P (out), MIPI_TX1/RX1_D1N (out), MIPI_TX1/RX1_D1P (out), MIPI_TX1/RX1_D2N (out), MIPI_TX1/RX1_D2P (out), MIPI_TX1/RX1_D3N (out), MIPI_TX1/RX1_D3P (out), TP_INT1 (in), TP_RST (in)

### Nets
GND: C128.2 C152.2 C154.2 C155.2 C287.2 C288.2 C311.2 C312.2 C313.2 C315.2 C316.2 C318.2 C319.2 J19.8(PWDN) J19.10(DVDD) J19.13(XCLK1) J19.16(Y7) J19.19(Y5) J19.22(Y2) J19.25(GND) J19.26(GND) J32.8(PWDN) J32.10(DVDD) J32.13(XCLK1) J32.16(Y7) J32.19(Y5) J32.22(Y2) J32.25(GND) J32.26(GND) J33.4 J33.15 J33.18 J33.21 J33.24 J33.27 J33.30 J33.31 J33.32 R241.2 X1.2(GND)
VCC1V8_DVP: C128.1 R209.1 X1.4(VCC)
VCC_3V0: C318.1 C319.1 J33.6
VCC_SYS: C152.1 C154.1 C287.1 C288.1 C312.1 C313.1 C315.1 C316.1 J19.1(NC) J32.1(NC) J33.1 J33.2 J33.3
BL_EN: J33.11 ; port BL_EN
CIF_PWR: J19.2(AGND) J32.2(AGND) ; port CIF_PWR
DVP_PWR: J19.3(SIO_D) J32.3(SIO_D) ; port DVP_PWR
I2C1_SCL: R76.1
I2C1_SCL_CAM: J19.5(SIO_C) J32.5(SIO_C) R76.2
I2C1_SDA: R77.1
I2C1_SDA_CAM: J19.4(AVDD) J32.4(AVDD) R77.2
I2C4_SCL: R245.1
I2C4_SCL_TP: J33.8 R245.2
I2C4_SDA: R246.1
I2C4_SDA_TP: J33.7 R246.2
LCD_BL_PWM1: J33.12 ; port LCD_BL_PWM1
LCD_EN: J33.9 ; port LCD_EN
LCD_RST: J33.13 ; port LCD_RST
MIPI_MCLK0: C155.1 C311.1 J19.9(HREF) J32.9(HREF) R239.2 R284.2
MIPI_RST: J19.6(RESET) J32.6(RESET)
MIPI_RX0_CLKN: J19.18(Y6) ; port MIPI_RX0_CLKN
MIPI_RX0_CLKP: J19.17(PCLK) ; port MIPI_RX0_CLKP
MIPI_RX0_D0N: J19.24(Y0) ; port MIPI_RX0_D0N
MIPI_RX0_D0P: J19.23(Y1) ; port MIPI_RX0_D0P
MIPI_RX0_D1N: J19.21(Y3) ; port MIPI_RX0_D1N
MIPI_RX0_D1P: J19.20(Y4) ; port MIPI_RX0_D1P
MIPI_RX0_D2N: J19.15(DGND) ; port MIPI_RX0_D2N
MIPI_RX0_D2P: J19.14(Y8) ; port MIPI_RX0_D2P
MIPI_RX0_D3N: J19.12(Y9) ; port MIPI_RX0_D3N
MIPI_RX0_D3P: J19.11(DOVDD) ; port MIPI_RX0_D3P
MIPI_TX0_CLKN: J33.23 ; port MIPI_TX0_CLKN
MIPI_TX0_CLKP: J33.22 ; port MIPI_TX0_CLKP
MIPI_TX0_D0N: J33.17 ; port MIPI_TX0_D0N
MIPI_TX0_D0P: J33.16 ; port MIPI_TX0_D0P
MIPI_TX0_D1N: J33.20 ; port MIPI_TX0_D1N
MIPI_TX0_D1P: J33.19 ; port MIPI_TX0_D1P
MIPI_TX0_D2N: J33.26 ; port MIPI_TX0_D2N
MIPI_TX0_D2P: J33.25 ; port MIPI_TX0_D2P
MIPI_TX0_D3N: J33.29 ; port MIPI_TX0_D3N
MIPI_TX0_D3P: J33.28 ; port MIPI_TX0_D3P
MIPI_TX1/RX1_CLKN: J32.18(Y6) ; port MIPI_TX1/RX1_CLKN
MIPI_TX1/RX1_CLKP: J32.17(PCLK) ; port MIPI_TX1/RX1_CLKP
MIPI_TX1/RX1_D0N: J32.24(Y0) ; port MIPI_TX1/RX1_D0N
MIPI_TX1/RX1_D0P: J32.23(Y1) ; port MIPI_TX1/RX1_D0P
MIPI_TX1/RX1_D1N: J32.21(Y3) ; port MIPI_TX1/RX1_D1N
MIPI_TX1/RX1_D1P: J32.20(Y4) ; port MIPI_TX1/RX1_D1P
MIPI_TX1/RX1_D2N: J32.15(DGND) ; port MIPI_TX1/RX1_D2N
MIPI_TX1/RX1_D2P: J32.14(Y8) ; port MIPI_TX1/RX1_D2P
MIPI_TX1/RX1_D3N: J32.12(Y9) ; port MIPI_TX1/RX1_D3N
MIPI_TX1/RX1_D3P: J32.11(DOVDD) ; port MIPI_TX1/RX1_D3P
TP_INT1: J33.10 ; port TP_INT1
NetJ18_2: R239.1 ; port GPIO2_B3/SPI2_CLK
NetJ19_7: J19.7(VSYNC) ; port GPIO2_A1/DVP_PDN1_H
NetJ24_3: J33.14 ; port TP_RST
NetJ32_7: J32.7(VSYNC) ; port GPIO2_B0/DVP_PDN0_H
NetJ33_5: J33.5 R241.1
NetR209_2: R209.2 X1.1(OE)
NetR284_1: R284.1 X1.3(OUT)

### Notes on the sheet
- MIPI  RX  CAMERA
- MIPI CAMERA
- MIPI_TX
- [page 17 of 21 - PDF]
  - Create:  SOT.SchLib
  - No footprint: J19, J32, J33, X1
- (in symbol Cap) C0G
- (in symbol CRY_D2520) DSO221SHF-24MHZ-1.8V; NC/DSO221SHF-24MHZ-1.8V
- (in symbol FPC_24PIN_0D5) Front-Camera

### Library data of the parts
C128 C152 C154 C155 C287 C288 C311-C313 C315 C316 C318 C319 = Cap: Capacitor; Published: 8-Jun-2000; LatestRevisionDate: 17-Jul-2002; LatestRevisionNote: Re-released for DXP Platform.; PackageReference: RAD-0.3; Publisher: Altium Limited; PackageDescription: Radial Cap, Thru-Hole; 2 Leads; 0.3 in Pin Spacing
J33 = FPC-30PIN-0D5
R76 R77 R209 R239 R241 R245 R246 R284 = Res-SMD: as R19 on sheet FAN; Published: 08/06/2000; Publisher: Altium Hobart Technology Centre

## Sheet eDP.SchDoc
size B
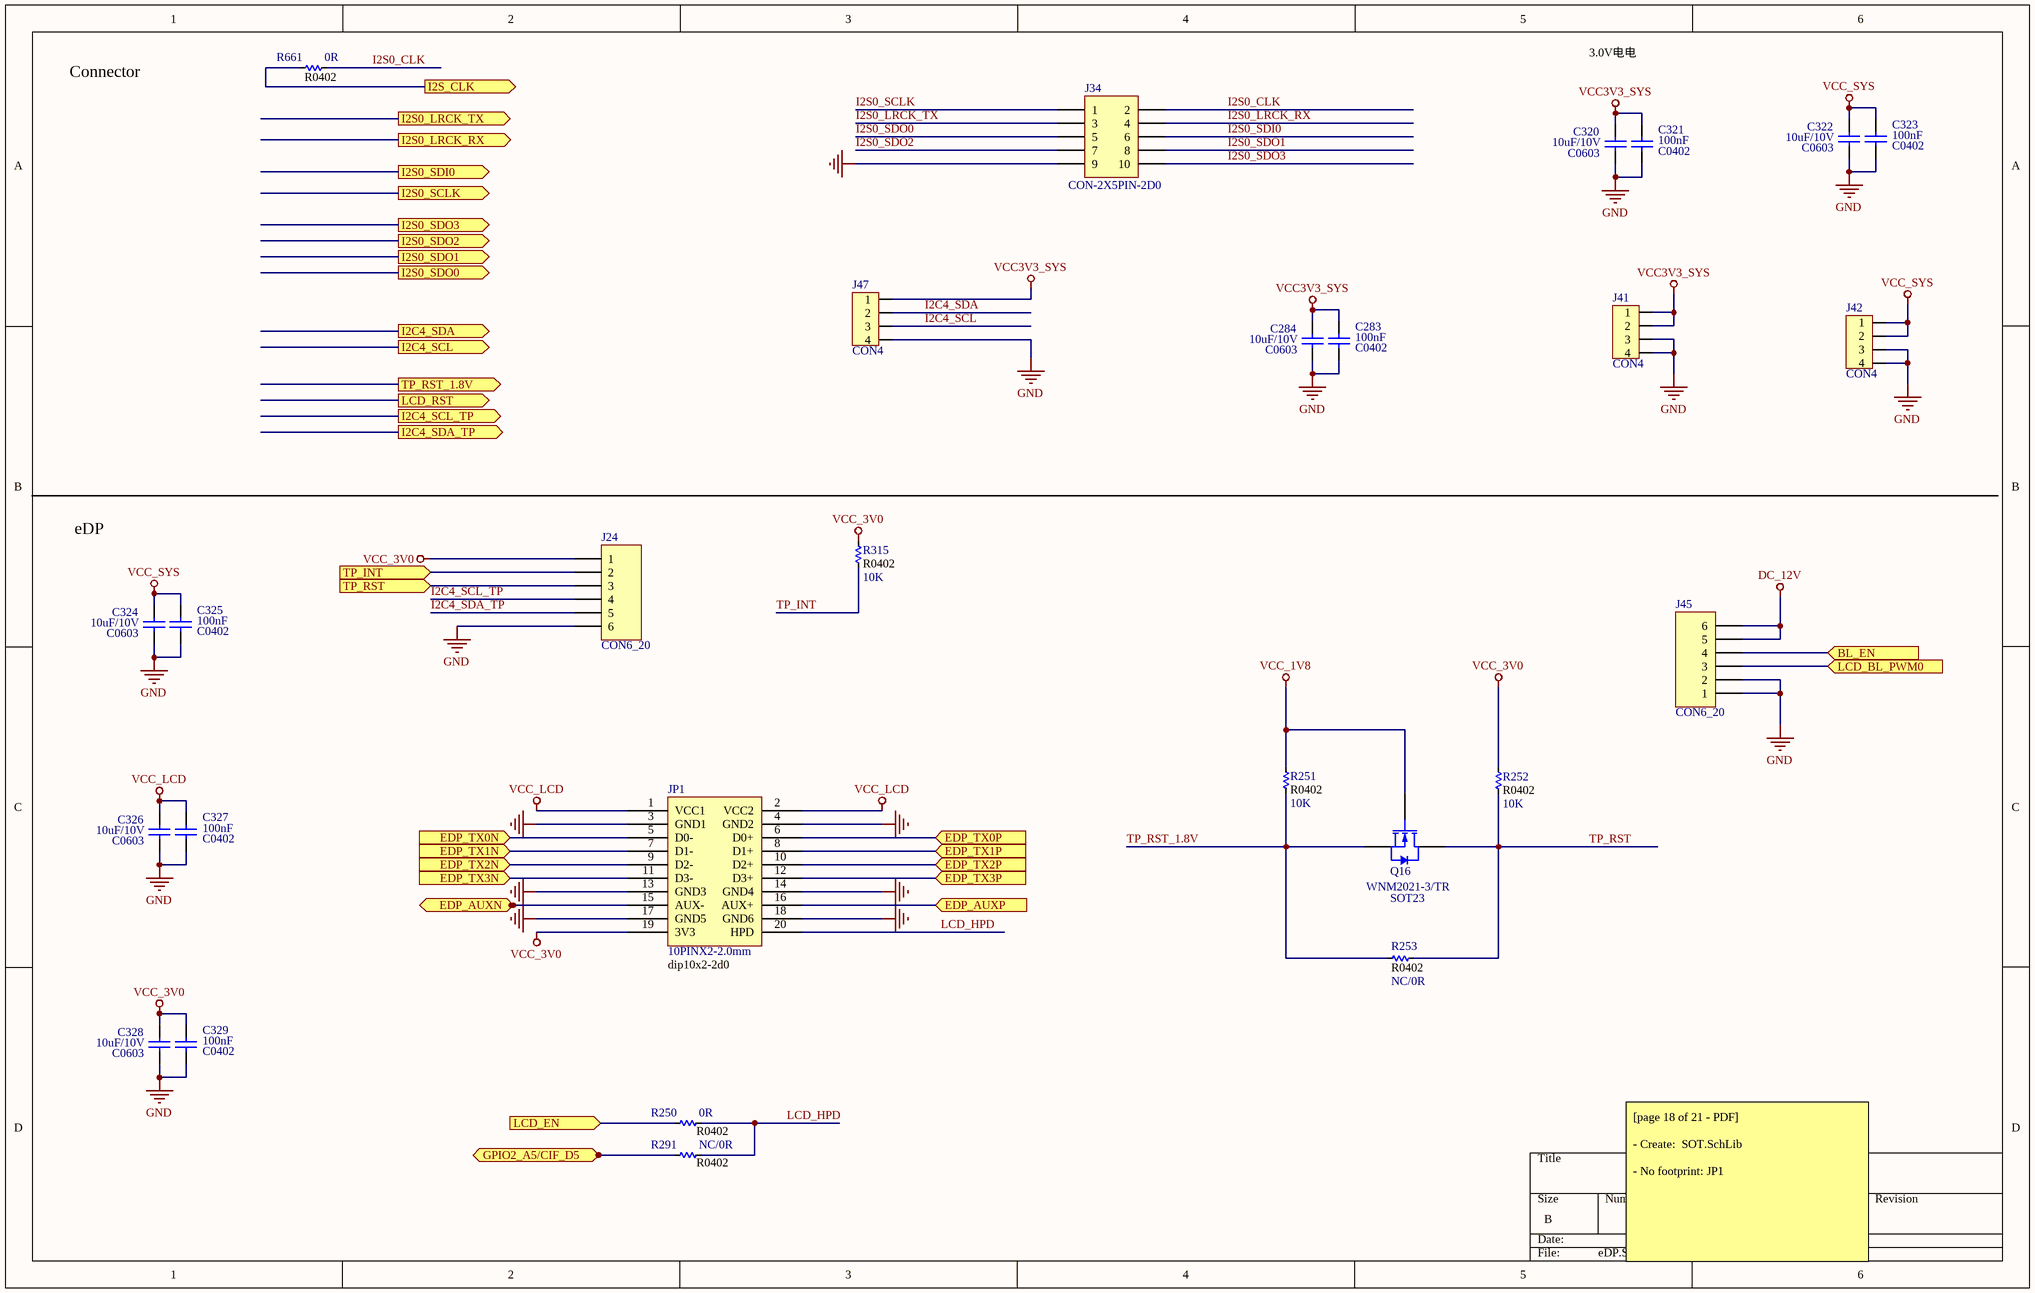
[diagram p24: eDP.SchDoc]

### Parts
C283  C0402  value 100nF  [C 0402]
C284  C0603  value 10uF/10V  [C 0603]
C320  C0603  value 10uF/10V  [C 0603]
C321  C0402  value 100nF  [C 0402]
C322  C0603  value 10uF/10V  [C 0603]
C323  C0402  value 100nF  [C 0402]
C324  C0603  value 10uF/10V  [C 0603]
C325  C0402  value 100nF  [C 0402]
C326  C0603  value 10uF/10V  [C 0603]
C327  C0402  value 100nF  [C 0402]
C328  C0603  value 10uF/10V  [C 0603]
C329  C0402  value 100nF  [C 0402]
J24  CON6_20  [Header6]
J34  CON-2X5PIN-2D0  [Hed2X5]
J41  CON4  [CON4]
J42  CON4  [CON4]
J45  CON6_20  [Header6]
J47  CON4  [CON4]
JP1  10PINX2-2.0mm  [JP10-D2T]
Q16  WNM2021-3/TR  [SOT23]
R250  R0402  value 0R  [R 0402]
R251  R0402  value 10K  [R 0402]
R252  R0402  value 10K  [R 0402]
R253  R0402  value NC/0R  [R 0402]
R291  R0402  value NC/0R  [R 0402]
R315  R0402  value 10K  [R 0402]
R661  R0402  value 0R  [R 0402]

### Ports
BL_EN (in), EDP_AUXN (in), EDP_AUXP (in), EDP_TX0N (in), EDP_TX0P (in), EDP_TX1N (in), EDP_TX1P (in), EDP_TX2N (in), EDP_TX2P (in), EDP_TX3N (in), EDP_TX3P (in), GPIO2_A5/CIF_D5 (in), I2C4_SCL (out), I2C4_SCL_TP (out), I2C4_SDA (out), I2C4_SDA_TP (out), I2S0_LRCK_RX (out), I2S0_LRCK_TX (out), I2S0_SCLK (out), I2S0_SDI0 (out), I2S0_SDO0 (out), I2S0_SDO1 (out), I2S0_SDO2 (out), I2S0_SDO3 (out), I2S_CLK (out), LCD_BL_PWM0 (in), LCD_EN (in), LCD_RST (out), TP_INT (in), TP_RST (in), TP_RST_1.8V (out)

### Nets
DC_12V: J45.5 J45.6
GND: C283.2 C284.2 C320.2 C321.2 C322.2 C323.2 C324.2 C325.2 C326.2 C327.2 C328.2 C329.2 J24.6 J34.9 J41.3 J41.4 J42.3 J42.4 J45.1 J45.2 J47.4 JP1.3(GND1) JP1.4(GND2) JP1.13(GND3) JP1.14(GND4) JP1.17(GND5) JP1.18(GND6)
VCC3V3_SYS: C283.1 C284.1 C320.1 C321.1 J41.1 J41.2 J47.1  [project net U27_VCC]
VCC_1V8: Q16.3(G) R251.2
VCC_3V0: C328.1 C329.1 J24.1 JP1.19(3V3) R252.2 R315.2
VCC_LCD: C326.1 C327.1 JP1.1(VCC1) JP1.2(VCC2)
VCC_SYS: C322.1 C323.1 C324.1 C325.1 J42.1 J42.2
BL_EN: J45.4 ; port BL_EN
EDP_AUXN: JP1.15(AUX-) ; port EDP_AUXN
EDP_AUXP: JP1.16(AUX+) ; port EDP_AUXP
EDP_TX0N: JP1.5(D0-) ; port EDP_TX0N
EDP_TX0P: JP1.6(D0+) ; port EDP_TX0P
EDP_TX1N: JP1.7(D1-) ; port EDP_TX1N
EDP_TX1P: JP1.8(D1+) ; port EDP_TX1P
EDP_TX2N: JP1.9(D2-) ; port EDP_TX2N
EDP_TX2P: JP1.10(D2+) ; port EDP_TX2P
EDP_TX3N: JP1.11(D3-) ; port EDP_TX3N
EDP_TX3P: JP1.12(D3+) ; port EDP_TX3P
I2C4_SCL: J47.3
I2C4_SCL_TP: J24.4
I2C4_SDA: J47.2
I2C4_SDA_TP: J24.5
I2S0_CLK: J34.2 R661.2
I2S0_LRCK_RX: J34.4
I2S0_LRCK_TX: J34.3
I2S0_SCLK: J34.1
I2S0_SDI0: J34.6
I2S0_SDO0: J34.5
I2S0_SDO1: J34.8
I2S0_SDO2: J34.7
I2S0_SDO3: J34.10
I2S_CLK: R661.1 ; port I2S_CLK
LCD_BL_PWM0: J45.3 ; port LCD_BL_PWM0
LCD_EN: R250.1 ; port LCD_EN
LCD_HPD: JP1.20(HPD) R250.2 R291.2
TP_INT: R315.1
TP_RST: Q16.1(D) R252.1 R253.1
TP_RST_1.8V: Q16.2(S) R251.1 R253.2
NetJ24_2: J24.2 ; port TP_INT
NetJ24_3: J24.3 ; port TP_RST
NetJ38_75: R291.1 ; port GPIO2_A5/CIF_D5

### Notes on the sheet
- Connector
- 3.0V电电
- eDP
- [page 18 of 21 - PDF]
  - Create:  SOT.SchLib
  - No footprint: JP1
- (in symbol 10PINX2-2.0mm) dip10x2-2d0

### Library data of the parts
C283 C284 C320-C329 = Cap: Capacitor; Published: 8-Jun-2000; LatestRevisionDate: 17-Jul-2002; LatestRevisionNote: Re-released for DXP Platform.; PackageReference: RAD-0.3; Publisher: Altium Limited; PackageDescription: Radial Cap, Thru-Hole; 2 Leads; 0.3 in Pin Spacing
J24 J45 = Header 6: Header, 6-Pin; LatestRevisionDate: 17-Jul-2002; LatestRevisionNote: Re-released for DXP Platform.; Publisher: Altium Limited
J34 = Header 5X2: Header, 5-Pin, Dual row; LatestRevisionDate: 17-Jul-2002; LatestRevisionNote: Re-released for DXP Platform.; Publisher: Altium Limited
J41 J42 J47 = Header4: Header IDC, 4 x 1 Pin Vertical 2.54mm Pitch (Non-Boxed, Male); Manufacturer: W¨¹rth Elektronik eiSos GmbH; partNo: 613002143121; ComponentLink1 Description: Manufacturer; ComponentLink2 Description: Datasheet; NoPins: 02; Created Date: 29 March 2013; ComponentLink1URL: http://www.we-online.com; ComponentLink2URL: http://katalog.we-online.de/em/datasheet/6130xx143121.pdf; Created by: Karrer Zheng
Q16 = ZXM61N02F: 20V N-Channel Enhancement Mode MOSFET; Published: 17-Dec-2003; DatasheetVersion: May-99; PackageVersion: 1996; PackageReference: SOT23; Publisher: Altium Limited; PackageDescription: SOT-23; 3 Leads; Body 3.1 x 2.5 mm, inc. leads (LxW max), Alternate Lead Configuration; ComponentLink1Description: Manufacturer Link; ComponentLink1URL: http://www.zetex.com/; ComponentLink2Description: Datasheet; ComponentLink2URL: www.zetex.com/3.0/pdf/ZXM61N02F.pdf
R250-R253 R291 R315 R661 = Res-SMD: as R19 on sheet FAN; Published: 08/06/2000; Publisher: Altium Hobart Technology Centre

## Nets that join several sheets
DC_12V: DC_IN (16 pins), MCU-TFCARD (C13.2 C14.2 R9.2 U2.5), SPI_UART (C363.1 C364.1 U44.2), MIPI_Panel (J101.1), FAN (C225.1 Q9.2 R183.2), 3G4G (5 pins), eDP (J45.5 J45.6)
GND: DC_IN (137 pins), MCU-TFCARD (32 pins), SPI_UART (45 pins), MXM_Connector (88 pins), MIPI_Panel (45 pins), HOST_PORT-USB2.0 (88 pins), TYPE_CO-USB3.0 (38 pins), HDMI_OUT (27 pins), HDMI_IN (102 pins), AUDIO_CODEC (60 pins), WIFI (47 pins), RJ45 (51 pins), FAN (27 pins), 3G4G (82 pins), CAMERA (40 pins), eDP (27 pins)
MCU_VCC5V: DC_IN (D1.1), MCU-TFCARD (10 pins)
U27_VCC: MCU-TFCARD (8 pins), SPI_UART (C106.2 C107.2 J18.1), MXM_Connector (5 pins), MIPI_Panel (11 pins), HDMI_OUT (D7.1), HDMI_IN (C182.1 C191.1 U18.1 U29.1), WIFI (C289.2 L4.2), FAN (7 pins), 3G4G (R207.2 R211.2), eDP (7 pins)
USB_5V: DC_IN (8 pins), HOST_PORT-USB2.0 (18 pins)
VCC1V8_DVP: MXM_Connector (C344.1 C345.1 J38.93), CAMERA (C128.1 R209.1 X1.4)
VCC3V3_S3: MXM_Connector (5 pins), RJ45 (C222.1 L10.1)
VCC_1V8: MCU-TFCARD (R23.2), MXM_Connector (C340.1 C341.1 J38.38 J38.40), MIPI_Panel (8 pins), WIFI (8 pins), RJ45 (Q8.3 R163.1), eDP (Q16.3 R251.2)
VCC_3V0: MXM_Connector (C338.1 C339.1 J38.34 J38.36), HDMI_OUT (6 pins), CAMERA (C318.1 C319.1 J33.6), eDP (6 pins)
VCC_LCD: MIPI_Panel (8 pins), eDP (C326.1 C327.1 JP1.1 JP1.2)
VCC_RTC: DC_IN (D1.2 D2.2), MXM_Connector (J38.42)
VCC_SYS: DC_IN (9 pins), SPI_UART (R267.2), MXM_Connector (13 pins), MIPI_Panel (C500.1 J101.3 R500.2 U91.4), HOST_PORT-USB2.0 (5 pins), TYPE_CO-USB3.0 (6 pins), HDMI_OUT (6 pins), HDMI_IN (6 pins), AUDIO_CODEC (C116.1 C117.1 FB1.1), WIFI (C169.2 U33.A2), CAMERA (13 pins), eDP (6 pins)
VCCA1V8_CODEC: MXM_Connector (C352.1 C353.1 J38.271 J38.273), AUDIO_CODEC (9 pins)
VCCA1V8_S3: MXM_Connector (C342.1 C343.1 J38.44), AUDIO_CODEC (R80.1 R106.2), FAN (R19.2 R182.1 R191.2)
VCCA3V0_CODEC: MXM_Connector (C350.1 C351.1 J38.267 J38.269), AUDIO_CODEC (C127.1 C129.1 U31.3)
3G_USB_DM: MXM_Connector (J38.134), 3G4G (J27.36)
3G_USB_DP: MXM_Connector (J38.136), 3G4G (J27.38)
ADC_IN0: MXM_Connector (J38.120), FAN (J109.1 R19.1)
BL_EN: MXM_Connector (J38.98), FAN (R190.2), CAMERA (J33.11), eDP (J45.4)
CIF_PWR: MXM_Connector (J38.110), CAMERA (J19.2 J32.2)
DVP_PWR: MXM_Connector (J38.112), CAMERA (J19.3 J32.3)
EDP_AUXN: MXM_Connector (J38.48), eDP (JP1.15)
EDP_AUXP: MXM_Connector (J38.50), eDP (JP1.16)
EDP_TX0N: MXM_Connector (J38.54), eDP (JP1.5)
EDP_TX0P: MXM_Connector (J38.56), eDP (JP1.6)
EDP_TX1N: MXM_Connector (J38.60), eDP (JP1.7)
EDP_TX1P: MXM_Connector (J38.62), eDP (JP1.8)
EDP_TX2N: MXM_Connector (J38.66), eDP (JP1.9)
EDP_TX2P: MXM_Connector (J38.68), eDP (JP1.10)
EDP_TX3N: MXM_Connector (J38.72), eDP (JP1.11)
EDP_TX3P: MXM_Connector (J38.74), eDP (JP1.12)
FAN_INT: MXM_Connector (J38.118), FAN (D11.1 R191.1 R195.1 R196.1)
I2C1_SCL: MXM_Connector (J38.309), HDMI_IN (U6.J5)
I2C1_SDA: MXM_Connector (J38.307), HDMI_IN (U6.K5)
I2C3_SCL_HDMI: MXM_Connector (J38.195), HDMI_OUT (Q4.2 R43.1)
I2C3_SDA_HDMI: MXM_Connector (J38.197), HDMI_OUT (Q5.2 R45.1)
I2C4_SCL: MCU-TFCARD (U27.3), MXM_Connector (J38.169), MIPI_Panel (R546.2)
I2C4_SDA: MCU-TFCARD (U27.4), MXM_Connector (J38.167), MIPI_Panel (R549.2)
I2S_CLK: MXM_Connector (J38.293), eDP (R661.1)
IR_INT: MCU-TFCARD (D5.2 R23.1), MXM_Connector (J38.177)
LCD_BL_PWM0: MXM_Connector (J38.265), eDP (J45.3)
LCD_BL_PWM1: MXM_Connector (J38.263), CAMERA (J33.12)
LCD_EN: MXM_Connector (J38.100), CAMERA (J33.9), eDP (R250.1)
LCD_RST: MXM_Connector (J38.249), CAMERA (J33.13)
MIPI_RX0_CLKN: MXM_Connector (J38.266), HDMI_IN (U6.C9), CAMERA (J19.18)
MIPI_RX0_CLKP: MXM_Connector (J38.264), HDMI_IN (U6.C10), CAMERA (J19.17)
MIPI_RX0_D0N: MXM_Connector (J38.254), HDMI_IN (U6.F9), CAMERA (J19.24)
MIPI_RX0_D0P: MXM_Connector (J38.252), HDMI_IN (U6.F10), CAMERA (J19.23)
MIPI_RX0_D1N: MXM_Connector (J38.260), HDMI_IN (U6.E9), CAMERA (J19.21)
MIPI_RX0_D1P: MXM_Connector (J38.258), HDMI_IN (U6.E10), CAMERA (J19.20)
MIPI_RX0_D2N: MXM_Connector (J38.272), HDMI_IN (U6.B9), CAMERA (J19.15)
MIPI_RX0_D2P: MXM_Connector (J38.270), HDMI_IN (U6.B10), CAMERA (J19.14)
MIPI_RX0_D3N: MXM_Connector (J38.278), HDMI_IN (U6.A9), CAMERA (J19.12)
MIPI_RX0_D3P: MXM_Connector (J38.276), HDMI_IN (U6.A10), CAMERA (J19.11)
MIPI_TX0_CLKN: MXM_Connector (J38.236), MIPI_Panel (R138.2), CAMERA (J33.23)
MIPI_TX0_CLKP: MXM_Connector (J38.234), MIPI_Panel (R35.2), CAMERA (J33.22)
MIPI_TX0_D0N: MXM_Connector (J38.224), MIPI_Panel (R22.2), CAMERA (J33.17)
MIPI_TX0_D0P: MXM_Connector (J38.222), MIPI_Panel (R21.2), CAMERA (J33.16)
MIPI_TX0_D1N: MXM_Connector (J38.230), MIPI_Panel (R34.2), CAMERA (J33.20)
MIPI_TX0_D1P: MXM_Connector (J38.228), MIPI_Panel (R24.2), CAMERA (J33.19)
MIPI_TX0_D2N: MXM_Connector (J38.242), MIPI_Panel (R248.2), CAMERA (J33.26)
MIPI_TX0_D2P: MXM_Connector (J38.240), MIPI_Panel (R221.2), CAMERA (J33.25)
MIPI_TX0_D3N: MXM_Connector (J38.248), MIPI_Panel (R255.2), CAMERA (J33.29)
MIPI_TX0_D3P: MXM_Connector (J38.246), MIPI_Panel (R254.2), CAMERA (J33.28)
MIPI_TX1/RX1_CLKN: MXM_Connector (J38.296), CAMERA (J32.18)
MIPI_TX1/RX1_CLKP: MXM_Connector (J38.294), CAMERA (J32.17)
MIPI_TX1/RX1_D0N: MXM_Connector (J38.308), CAMERA (J32.24)
MIPI_TX1/RX1_D0P: MXM_Connector (J38.306), CAMERA (J32.23)
MIPI_TX1/RX1_D1N: MXM_Connector (J38.302), CAMERA (J32.21)
MIPI_TX1/RX1_D1P: MXM_Connector (J38.300), CAMERA (J32.20)
MIPI_TX1/RX1_D2N: MXM_Connector (J38.290), CAMERA (J32.15)
MIPI_TX1/RX1_D2P: MXM_Connector (J38.288), CAMERA (J32.14)
MIPI_TX1/RX1_D3N: MXM_Connector (J38.284), CAMERA (J32.12)
MIPI_TX1/RX1_D3P: MXM_Connector (J38.282), CAMERA (J32.11)
NetC18_2: MCU-TFCARD (C18.2 R9.1 R11.2 U2.4), FAN (R188.1)
NetC585_2: SPI_UART (C585.2 R673.1 U106.8), MXM_Connector (J38.163)
NetJ18_2: SPI_UART (J18.2), MXM_Connector (J38.89), CAMERA (R239.1)
NetJ18_3: SPI_UART (J18.3), MXM_Connector (J38.63)
NetJ18_4: SPI_UART (J18.4), MXM_Connector (J38.81)
NetJ18_5: SPI_UART (J18.5), MXM_Connector (J38.87)
NetJ19_7: MXM_Connector (J38.67), CAMERA (J19.7)
NetJ24_2: MXM_Connector (J38.255), eDP (J24.2)
NetJ24_3: CAMERA (J33.14), eDP (J24.3)
NetJ32_7: MXM_Connector (J38.83), CAMERA (J32.7)
NetJ38_65: MCU-TFCARD (R312.1 U43.4), MXM_Connector (J38.65)
NetJ38_69: MXM_Connector (J38.69), FAN (R203.1)
NetJ38_71: MXM_Connector (J38.71), HDMI_IN (R257.2)
NetJ38_73: SPI_UART (R212.2), MXM_Connector (J38.73)
NetJ38_75: MXM_Connector (J38.75), eDP (R291.1)
NetJ38_77: MXM_Connector (J38.77), 3G4G (R249.2)
NetJ38_78: MXM_Connector (J38.78), MIPI_Panel (R258.2)
NetJ38_79: MXM_Connector (J38.79), FAN (R202.1)
NetJ38_99: SPI_UART (R313.2), MXM_Connector (J38.99)
NetJ38_101: SPI_UART (R314.2), MXM_Connector (J38.101)
NetJ38_114: MXM_Connector (J38.114), HDMI_IN (U6.J4)
NetJ38_165: MCU-TFCARD (R25.2 U4.3), MXM_Connector (J38.165)
NetJ38_179: MXM_Connector (J38.179), 3G4G (R256.2)
NetJ38_183: MXM_Connector (J38.183), HDMI_IN (U6.K6)
NetJ38_189: MXM_Connector (J38.189), MIPI_Panel (R292.2 R559.2)
NetJ38_204: MXM_Connector (J38.204), HDMI_OUT (L8.1 R304.2)
NetJ38_206: MXM_Connector (J38.206), HDMI_OUT (L8.2 R305.2)
NetJ38_208: MXM_Connector (J38.208), HDMI_OUT (L14.1 R307.2)
NetJ38_210: MXM_Connector (J38.210), HDMI_OUT (L14.2 R306.2)
NetJ38_212: MXM_Connector (J38.212), HDMI_OUT (L15.1 R308.2)
NetJ38_214: MXM_Connector (J38.214), HDMI_OUT (L15.2 R309.2)
NetJ38_216: MXM_Connector (J38.216), HDMI_OUT (L16.1 R310.2)
NetJ38_218: MXM_Connector (J38.218), HDMI_OUT (L16.2 R311.2)
NetR7_2: DC_IN (R7.2), FAN (R189.2)
OTP_RST: MXM_Connector (J38.241), FAN (R193.1)
PCIE_CLKREQ: MXM_Connector (J38.257), 3G4G (J28.52)
PCIE_REF_CLKN: MXM_Connector (J38.111), 3G4G (C246.1)
PCIE_REF_CLKP: MXM_Connector (J38.109), 3G4G (C245.1)
PCIE_RST: MXM_Connector (J38.259), 3G4G (J28.50)
PCIE_RX0_N: MXM_Connector (J38.121), 3G4G (J28.41)
PCIE_RX0_P: MXM_Connector (J38.123), 3G4G (J28.43)
PCIE_RX1_N: MXM_Connector (J38.133), 3G4G (J28.29)
PCIE_RX1_P: MXM_Connector (J38.135), 3G4G (J28.31)
PCIE_RX2_N: MXM_Connector (J38.145), 3G4G (J28.17)
PCIE_RX2_P: MXM_Connector (J38.147), 3G4G (J28.19)
PCIE_RX3_N: MXM_Connector (J38.157), 3G4G (J28.5)
PCIE_RX3_P: MXM_Connector (J38.159), 3G4G (J28.7)
PCIE_TX0N: MXM_Connector (J38.115), 3G4G (C248.1)
PCIE_TX0P: MXM_Connector (J38.117), 3G4G (C247.1)
PCIE_TX1N: MXM_Connector (J38.127), 3G4G (C251.1)
PCIE_TX1P: MXM_Connector (J38.129), 3G4G (C250.1)
PCIE_TX2N: MXM_Connector (J38.139), 3G4G (C253.1)
PCIE_TX2P: MXM_Connector (J38.141), 3G4G (C252.1)
PCIE_TX3N: MXM_Connector (J38.151), 3G4G (C257.1)
PCIE_TX3P: MXM_Connector (J38.153), 3G4G (C256.1)
PCIE_WAKE: MXM_Connector (J38.261), 3G4G (J28.54)
PE_RST: FAN (R192.1), 3G4G (C249.2 J27.22 R223.1)
POWER_ON: MXM_Connector (J38.173), FAN (R197.1)
PWR_KEY_L: MXM_Connector (J38.187), FAN (D16.1)
RECOVER: MXM_Connector (J38.122), FAN (C227.1 R182.2 R184.1)
RESET_L: MXM_Connector (J38.181), FAN (R186.1)
RTC_CLK_OUT: MXM_Connector (J38.201), 3G4G (J28.60)
SDMMC0_CLK: MCU-TFCARD (R29.1), MXM_Connector (J38.92)
SDMMC0_CMD: MCU-TFCARD (R28.1), MXM_Connector (J38.90)
SDMMC0_D0: MCU-TFCARD (R32.1), MXM_Connector (J38.94)
SDMMC0_D1: MCU-TFCARD (R33.1), MXM_Connector (J38.96)
SDMMC0_D2: MCU-TFCARD (R27.1), MXM_Connector (J38.86)
SDMMC0_D3: MCU-TFCARD (R30.1), MXM_Connector (J38.88)
SDMMC0_DET_L: MCU-TFCARD (ED3.1 J4.SWB), MXM_Connector (J38.84)
TP_INT1: MXM_Connector (J38.247), CAMERA (J33.10)
TYPEC0_DM: MXM_Connector (J38.182), TYPE_CO-USB3.0 (R26.1)
TYPEC0_DP: MXM_Connector (J38.184), TYPE_CO-USB3.0 (R31.1)
TYPEC0_RX1N: MXM_Connector (J38.192), TYPE_CO-USB3.0 (R74.1)
TYPEC0_RX1P: MXM_Connector (J38.190), TYPE_CO-USB3.0 (R75.1)
TYPEC0_TX1N: MXM_Connector (J38.186), TYPE_CO-USB3.0 (C30.2)
TYPEC0_TX1P: MXM_Connector (J38.188), TYPE_CO-USB3.0 (C31.2)
TYPEC0_U2VBUSDET: MXM_Connector (J38.106), TYPE_CO-USB3.0 (C115.1 D9.2 R81.2 R82.2)
UART2DBG_RX: MXM_Connector (J38.253), FAN (D20.1 R204.2)
UART2DBG_TX: MXM_Connector (J38.251), FAN (D6.2 R198.1)
USB3_DM: MXM_Connector (J38.172), TYPE_CO-USB3.0 (R68.2 R69.2)
USB3_SSRXN: MXM_Connector (J38.168), TYPE_CO-USB3.0 (R70.2)
USB3_SSRXP: MXM_Connector (J38.166), TYPE_CO-USB3.0 (R71.2)
USB3_SSTXN: MXM_Connector (J38.162), TYPE_CO-USB3.0 (C92.1)
USB3_SSTXP: MXM_Connector (J38.164), TYPE_CO-USB3.0 (C93.1)
VCC5V0_HOST_EN: MXM_Connector (J38.104), HDMI_IN (U3.4)